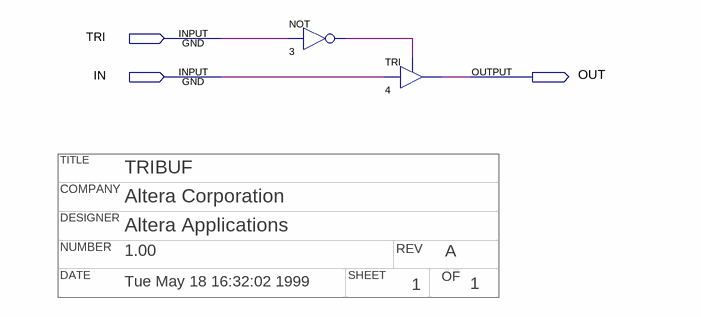
[diagram p0: schematic sheet]
// Quartus schematic tribuf.bdf as structural Verilog: 2 symbols, 3 pins
// Title block: TITLE: TRIBUF; COMPANY: Altera Corporation; DESIGNER: Altera Applications; NUMBER: 1.00; REV: A; DATE: Tue May 18 16:32:02 1999; SHEET: 1; OF: 1
module tribuf (
  input  TRI,
  input  IN,
  output OUT
);

  wire n3_out;

  not u_3 (n3_out, TRI);
  TRI u_4 (.IN(IN), .OE(n3_out), .OUT(OUT));
endmodule
